# Altium schematic sheet TopLevel.SchDoc: =project_title
size Tabloid; CompanyName: Luxonis Holding; Organization: Luxonis Holding; Address1: 1925 Harmony Park Drive; Address2: Westminster, CO; Address3: 80234; Address4: United States; SheetNumber: 2; SheetTotal: 12
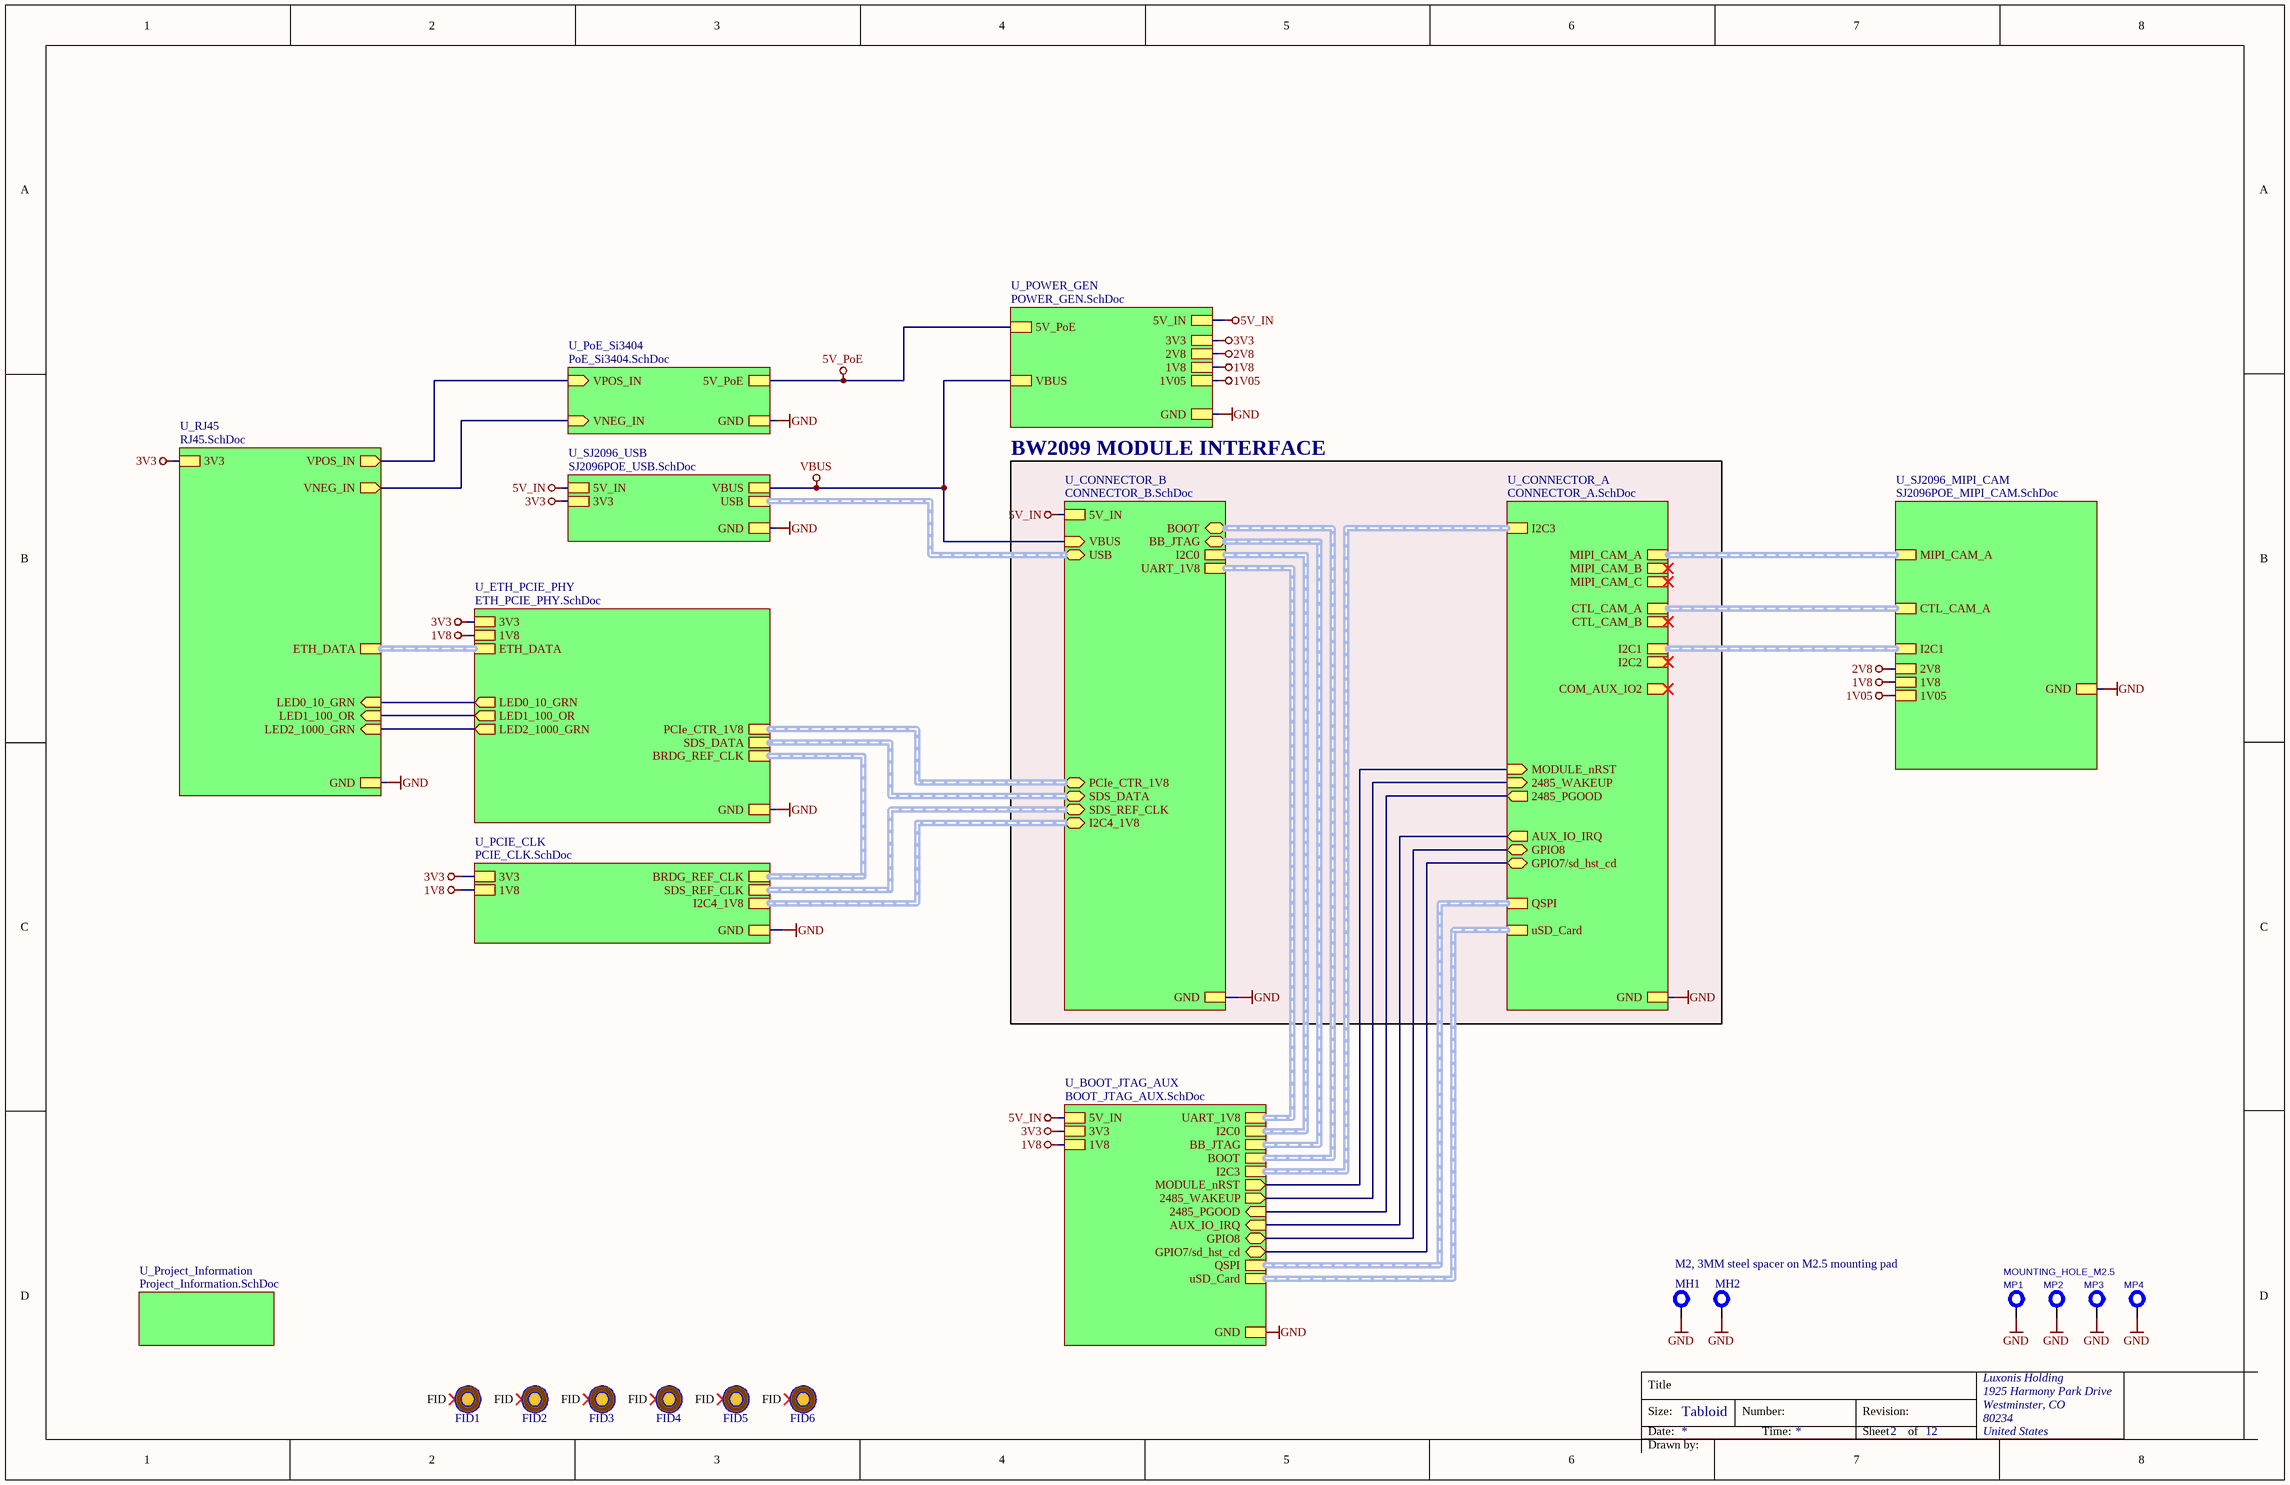
[diagram p0: TopLevel.SchDoc]

## Parts
FID1  FIDUCIAL_ROUND_1MM  [FIDUCIAL_ROUND_1MM]  (value not drawn)  (no BOM)
FID2  FIDUCIAL_ROUND_1MM  [FIDUCIAL_ROUND_1MM]  (value not drawn)  (no BOM)
FID3  FIDUCIAL_ROUND_1MM  [FIDUCIAL_ROUND_1MM]  (value not drawn)  (no BOM)
FID4  FIDUCIAL_ROUND_1MM  [FIDUCIAL_ROUND_1MM]  (value not drawn)  (no BOM)
FID5  FIDUCIAL_ROUND_1MM  [FIDUCIAL_ROUND_1MM]  (value not drawn)  (no BOM)
FID6  FIDUCIAL_ROUND_1MM  [FIDUCIAL_ROUND_1MM]  (value not drawn)  (no BOM)
MH1  M2, 3MM steel spacer on M2.5 mounting pad  [9774030243R]
MH2  M2, 3MM steel spacer on M2.5 mounting pad  [9774030243R]  (value not drawn)
MP1  MOUNTING_HOLE_M2.5  [MOUNTING_HOLE_M2.5]  (no BOM)
MP2  MOUNTING_HOLE_M2.5  [MOUNTING_HOLE_M2.5]  (value not drawn)  (no BOM)
MP3  MOUNTING_HOLE_M2.5  [MOUNTING_HOLE_M2.5]  (value not drawn)  (no BOM)
MP4  MOUNTING_HOLE_M2.5  [MOUNTING_HOLE_M2.5]  (value not drawn)  (no BOM)

## Sub-sheets
U_BOOT_JTAG_AUX = BOOT_JTAG_AUX.SchDoc: GPIO8 (bidir), AUX_IO_IRQ (in), BOOT (harness BOOT), BB_JTAG (harness BB_JTAG), uSD_Card (harness uSD_Card), 2485_WAKEUP (out), QSPI (harness QSPI), I2C3 (harness I2C3), MODULE_nRST (out), UART_1V8 (harness UART_1V8), 2485_PGOOD (in), 1V8, 3V3, GND, 5V_IN, I2C0 (harness I2C0), GPIO7/sd_hst_cd (bidir)
U_CONNECTOR_A = CONNECTOR_A.SchDoc: AUX_IO_IRQ (out), I2C2 (harness I2C2), I2C1 (harness I2C1), QSPI (harness QSPI), uSD_Card (harness uSD_Card), MIPI_CAM_C (harness MIPI_CAM_C), CTL_CAM_A (harness CTL_CAM_A), MIPI_CAM_A (harness MIPI_CAM_A), MIPI_CAM_B (harness MIPI_CAM_B), GPIO8 (bidir), GND, I2C3 (harness I2C3), CTL_CAM_B (harness CTL_CAM_B), COM_AUX_IO2 (out), MODULE_nRST (in), 2485_WAKEUP (in), 2485_PGOOD (out), GPIO7/sd_hst_cd (bidir)
U_CONNECTOR_B = CONNECTOR_B.SchDoc: VBUS (in), UART_1V8 (harness UART_1V8), I2C0 (harness I2C0), 5V_IN, GND, BOOT (bidir, harness BOOT), PCIe_CTR_1V8 (bidir, harness PCIe_CTR_1V8), BB_JTAG (bidir, harness BB_JTAG), USB (bidir, harness USB), SDS_REF_CLK (bidir, harness SDS_REF_CLK), I2C4_1V8 (bidir, harness I2C4_1V8), SDS_DATA (bidir, harness Harness)
U_ETH_PCIE_PHY = ETH_PCIE_PHY.SchDoc: ETH_DATA (harness ETH_DATA), LED0_10_GRN (out), LED1_100_OR (out), LED2_1000_GRN (out), SDS_DATA (harness Harness), 3V3, GND, BRDG_REF_CLK (harness BRDG_REF_CLK), 1V8, PCIe_CTR_1V8 (harness PCIe_CTR_1V8)
U_PCIE_CLK = PCIE_CLK.SchDoc: BRDG_REF_CLK (harness BRDG_REF_CLK), SDS_REF_CLK (harness SDS_REF_CLK), GND, 3V3, 1V8, I2C4_1V8 (harness I2C4_1V8)
U_PoE_Si3404 = PoE_Si3404.SchDoc: 5V_PoE, GND, VPOS_IN (in), VNEG_IN (in)
U_POWER_GEN = POWER_GEN.SchDoc: GND, 3V3, 5V_IN, 1V8, 1V05, 2V8, VBUS, 5V_PoE
U_Project_Information = Project_Information.SchDoc: no entries
U_RJ45 = RJ45.SchDoc: ETH_DATA (harness ETH_DATA), GND, LED0_10_GRN (in), 3V3, LED2_1000_GRN (in), LED1_100_OR (in), VPOS_IN (out), VNEG_IN (out)
U_SJ2096_MIPI_CAM = SJ2096POE_MIPI_CAM.SchDoc: I2C1 (harness I2C1), MIPI_CAM_A (harness MIPI_CAM_A), GND, CTL_CAM_A (harness CTL_CAM_A), 2V8, 1V8, 1V05
U_SJ2096_USB = SJ2096POE_USB.SchDoc: USB (harness USB), GND, 5V_IN, 3V3, VBUS

## Nets
1V05: sheet U_SJ2096_MIPI_CAM/1V05, sheet U_POWER_GEN/1V05
1V8: sheet U_ETH_PCIE_PHY/1V8, sheet U_PCIE_CLK/1V8, sheet U_SJ2096_MIPI_CAM/1V8, sheet U_BOOT_JTAG_AUX/1V8, sheet U_POWER_GEN/1V8
2V8: sheet U_SJ2096_MIPI_CAM/2V8, sheet U_POWER_GEN/2V8
3V3: sheet U_ETH_PCIE_PHY/3V3, sheet U_RJ45/3V3, sheet U_PCIE_CLK/3V3, sheet U_SJ2096_USB/3V3, sheet U_BOOT_JTAG_AUX/3V3, sheet U_POWER_GEN/3V3
5V_IN: sheet U_CONNECTOR_B/5V_IN, sheet U_SJ2096_USB/5V_IN, sheet U_BOOT_JTAG_AUX/5V_IN, sheet U_POWER_GEN/5V_IN
5V_PoE: sheet U_PoE_Si3404/5V_PoE, sheet U_POWER_GEN/5V_PoE
GND: MH1.1 MH2.1 MP1.1 MP2.1 MP3.1 MP4.1 ; sheet U_CONNECTOR_B/GND, sheet U_CONNECTOR_A/GND, sheet U_ETH_PCIE_PHY/GND, sheet U_RJ45/GND, sheet U_PCIE_CLK/GND, sheet U_SJ2096_MIPI_CAM/GND, sheet U_SJ2096_USB/GND, sheet U_BOOT_JTAG_AUX/GND, sheet U_PoE_Si3404/GND, sheet U_POWER_GEN/GND
VBUS: sheet U_CONNECTOR_B/VBUS, sheet U_SJ2096_USB/VBUS, sheet U_POWER_GEN/VBUS
(unnamed): sheet U_CONNECTOR_A/AUX_IO_IRQ, sheet U_BOOT_JTAG_AUX/AUX_IO_IRQ
(unnamed): sheet U_CONNECTOR_A/GPIO8, sheet U_BOOT_JTAG_AUX/GPIO8
(unnamed): sheet U_CONNECTOR_A/MODULE_nRST, sheet U_BOOT_JTAG_AUX/MODULE_nRST
(unnamed): sheet U_CONNECTOR_A/2485_WAKEUP, sheet U_BOOT_JTAG_AUX/2485_WAKEUP
(unnamed): sheet U_CONNECTOR_A/2485_PGOOD, sheet U_BOOT_JTAG_AUX/2485_PGOOD
(unnamed): sheet U_CONNECTOR_A/GPIO7/sd_hst_cd, sheet U_BOOT_JTAG_AUX/GPIO7/sd_hst_cd
(unnamed): sheet U_ETH_PCIE_PHY/LED0_10_GRN, sheet U_RJ45/LED0_10_GRN
(unnamed): sheet U_ETH_PCIE_PHY/LED1_100_OR, sheet U_RJ45/LED1_100_OR
(unnamed): sheet U_ETH_PCIE_PHY/LED2_1000_GRN, sheet U_RJ45/LED2_1000_GRN
(unnamed): sheet U_RJ45/VPOS_IN, sheet U_PoE_Si3404/VPOS_IN
(unnamed): sheet U_RJ45/VNEG_IN, sheet U_PoE_Si3404/VNEG_IN

Not connected (* = marked no-connect by the designer): FID1 FID*; FID2 FID*; FID3 FID*; FID4 FID*; FID5 FID*; FID6 FID*

## Buses and harness runs
harness sheet U_BOOT_JTAG_AUX/BB_JTAG = sheet U_CONNECTOR_B/BB_JTAG
harness sheet U_BOOT_JTAG_AUX/BOOT = sheet U_CONNECTOR_B/BOOT
harness sheet U_BOOT_JTAG_AUX/I2C0 = sheet U_CONNECTOR_B/I2C0
harness sheet U_BOOT_JTAG_AUX/I2C3 = sheet U_CONNECTOR_A/I2C3
harness sheet U_BOOT_JTAG_AUX/QSPI = sheet U_CONNECTOR_A/QSPI
harness sheet U_BOOT_JTAG_AUX/UART_1V8 = sheet U_CONNECTOR_B/UART_1V8
harness sheet U_BOOT_JTAG_AUX/uSD_Card = sheet U_CONNECTOR_A/uSD_Card
harness sheet U_CONNECTOR_A/CTL_CAM_A = sheet U_SJ2096_MIPI_CAM/CTL_CAM_A
harness sheet U_CONNECTOR_A/I2C1 = sheet U_SJ2096_MIPI_CAM/I2C1
harness sheet U_CONNECTOR_A/MIPI_CAM_A = sheet U_SJ2096_MIPI_CAM/MIPI_CAM_A
harness sheet U_CONNECTOR_B/I2C4_1V8 = sheet U_PCIE_CLK/I2C4_1V8
harness sheet U_CONNECTOR_B/PCIe_CTR_1V8 = sheet U_ETH_PCIE_PHY/PCIe_CTR_1V8
harness sheet U_CONNECTOR_B/SDS_DATA = sheet U_ETH_PCIE_PHY/SDS_DATA
harness sheet U_CONNECTOR_B/SDS_REF_CLK = sheet U_PCIE_CLK/SDS_REF_CLK
harness sheet U_CONNECTOR_B/USB = sheet U_SJ2096_USB/USB
harness sheet U_ETH_PCIE_PHY/BRDG_REF_CLK = sheet U_PCIE_CLK/BRDG_REF_CLK
harness sheet U_ETH_PCIE_PHY/ETH_DATA = sheet U_RJ45/ETH_DATA

## Notes on the sheet
- BW2099 MODULE INTERFACE
- Title
- Size:
- Date:
- Tabloid
- Number:
- Time:
- Revision:
- Sheet
- of
- Drawn by:

## Library data of the parts
FID1-FID6 = FIDUCIAL: Fiducial with various available footprints
MH1 MH2 = 9774030243R: MP ROUND STANDOFF M2X0.4 STEEL 3MM; Manufacturer 1: Wurth Electronics; Plating: Tin; Threaded/Unthreaded: Threaded; Outside Diameter: 0.171inch; Supplier 1: Digi-Key; Manufacturer Part Number 1: 9774030243R; Stock 1: 20568; Pricing 1: 1=0.95000, 10=0.91800, 50=0.79500, 100=0.73900 (USD); RoHS: Yes; Material: Steel; Length: 0.173inch; REACH SVHC: Unknown; ComponentLink1URL: http://www.mouser.com/ds/2/445/9774030243R-611455.pdf?src-supplier=Mouser; ComponentLink1Description: http://www.mouser.com/ds/2/445/9774030243R-611455.pdf?src-supplier=Mouser; ComponentLink2URL: http://www.farnell.com/datasheets/1960368.pdf?src-supplier=Farnell; ComponentLink2Description: http://www.farnell.com/datasheets/1960368.pdf?src-supplier=Farnell; ComponentLink3URL: https://katalog.we-online.de/em/datasheet/9774030243R.pdf?src-supplier=Digi-Key; ComponentLink3Description: https://katalog.we-online.de/em/datasheet/9774030243R.pdf?src-supplier=Digi-Key; ComponentLink4URL: http://www.farnell.com/datasheets/1960368.pdf?src-supplier=Newark; ComponentLink4Description: http://www.farnell.com/datasheets/1960368.pdf?src-supplier=Newark; ComponentLink5URL: http://www.farnell.com/datasheets/1960368.pdf?src-supplier=Element14; ComponentLink5Description: http://www.farnell.com/datasheets/1960368.pdf?src-supplier=Element14; Supplier Part Number 1: 732-7085-1-ND; Supplier 2: Mouser; Supplier Part Number 2: 710-9774030243R; Supplier 3: Element14; Supplier Part Number 3: 2497599
MP1-MP4 = MP_Mounting-Holes: =CurrentFootprint; B - Value: Not a Part; A - Level: 0